# Altium schematic sheet карточка.SchDoc
size A3; SheetNumber: 1; SheetTotal: 1
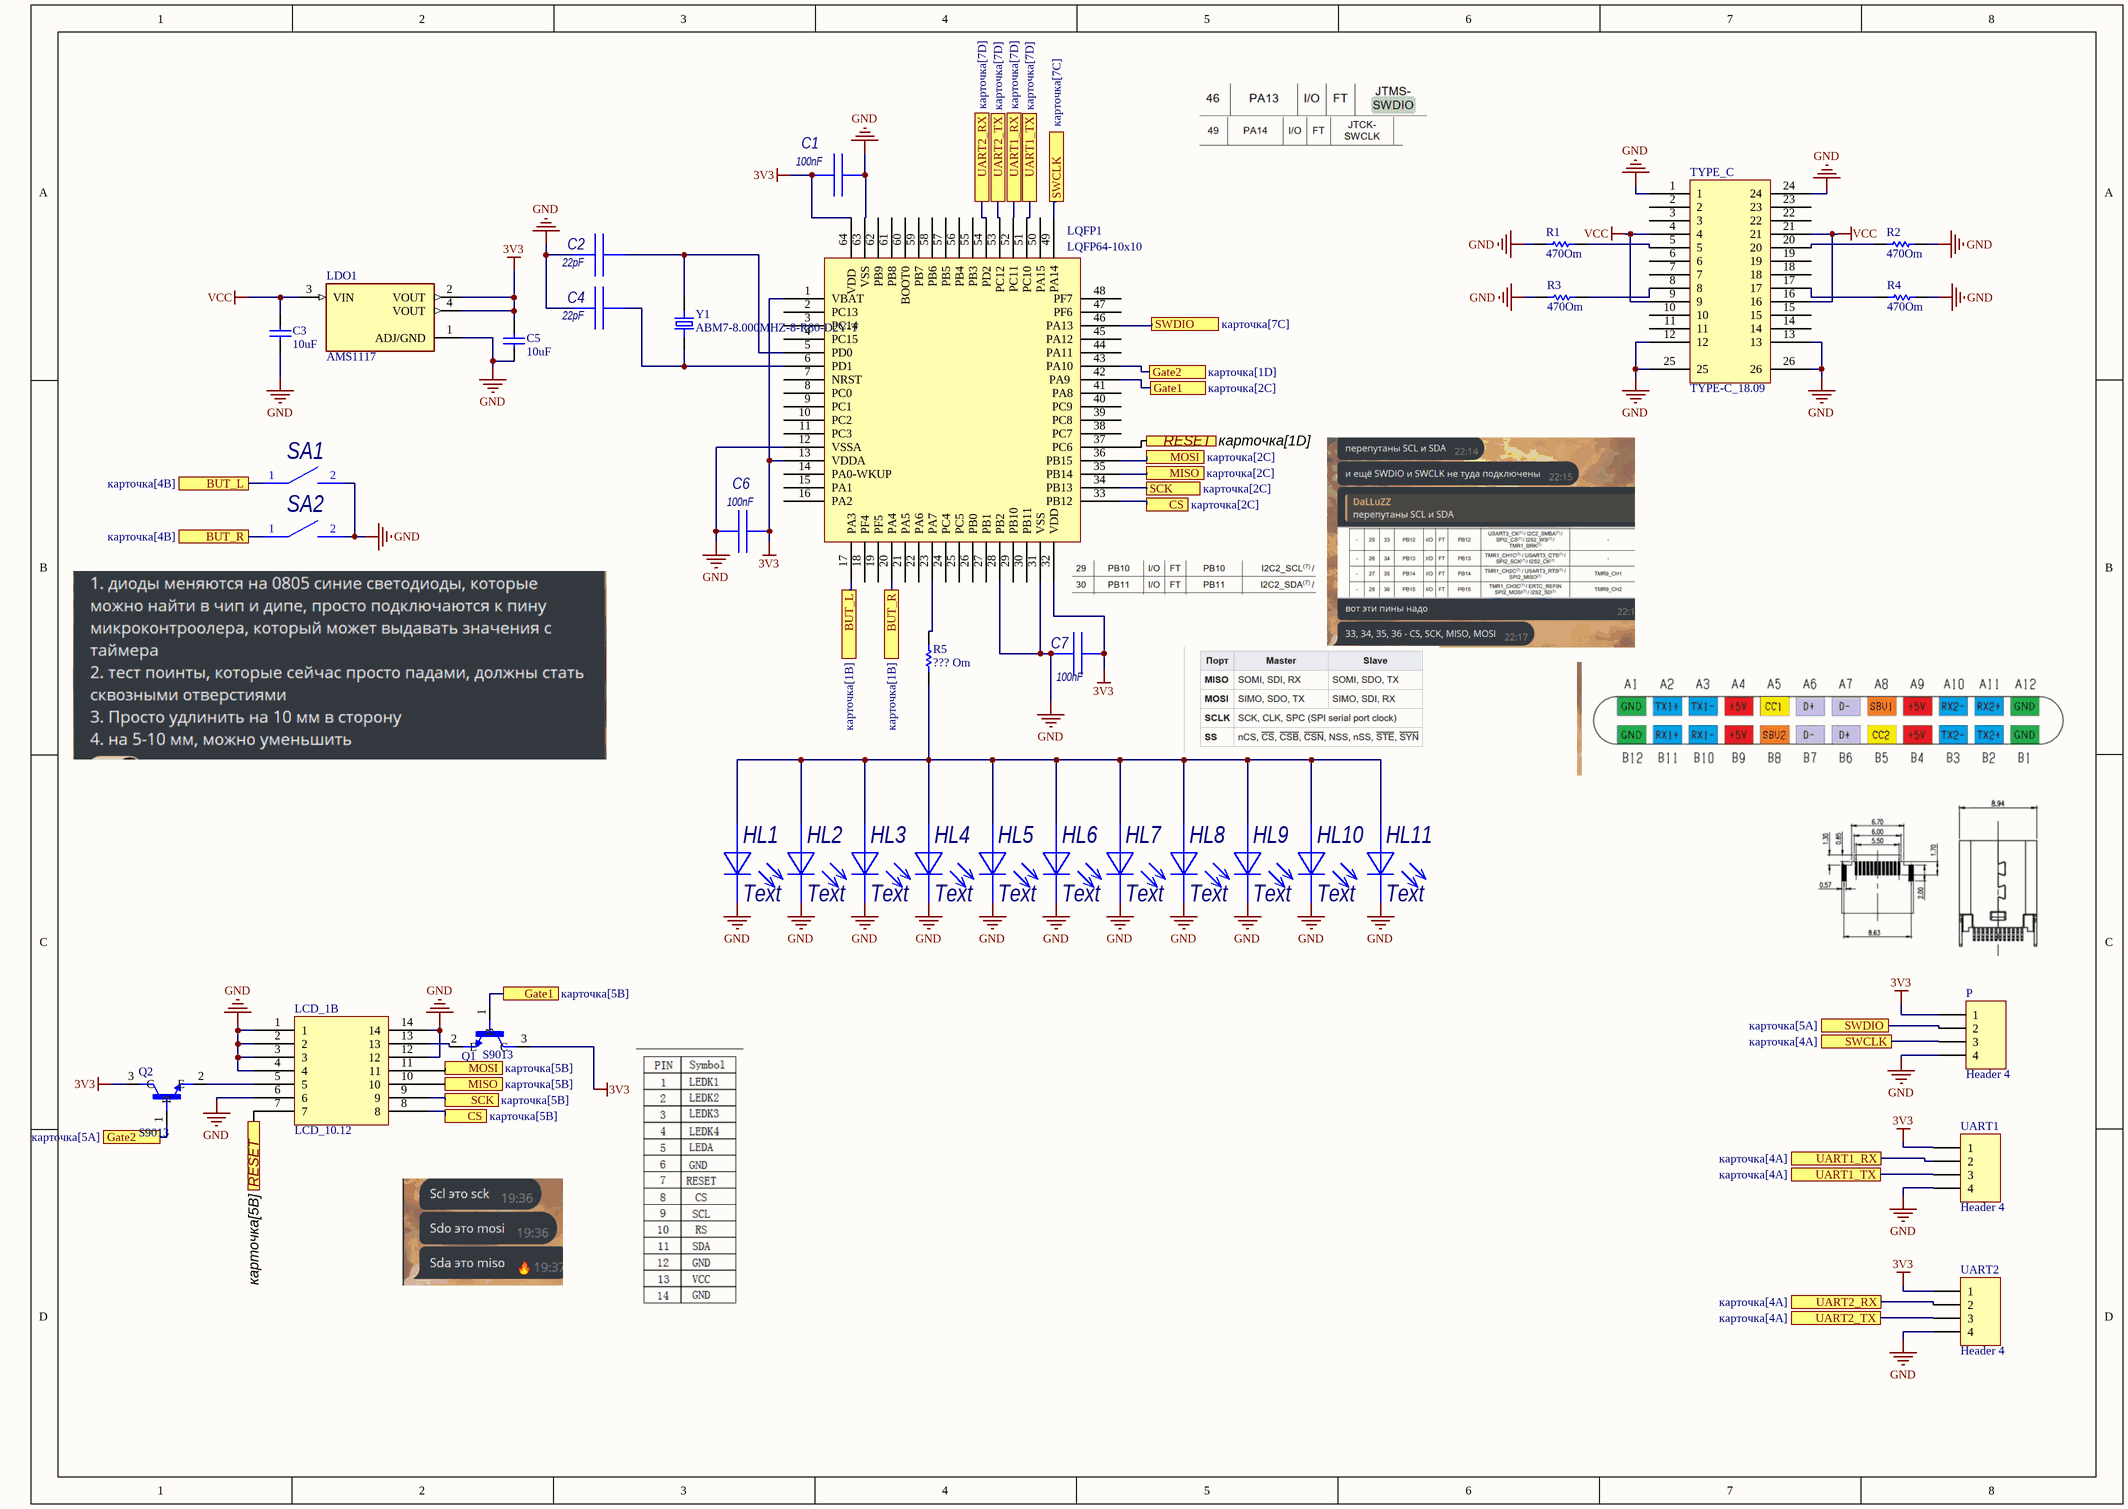
[diagram p0: карточка.SchDoc]

## Parts
C1  100nF  [C0603]
C2  22pF  [C0603]
C3  value 10uF  [C0805]  (hidden comment: Capacitor)
C4  22pF  [C0603]
C5  value 10uF  [C0805]  (hidden comment: Capacitor)
C6  100nF  [C0603]
C7  100nF  [C0603]
HL1  Text  [LD0805]
HL2  Text  [LD0805]
HL3  Text  [LD0805]
HL4  Text  [LD0805]
HL5  Text  [LD0805]
HL6  Text  [LD0805]
HL7  Text  [LD0805]
HL8  Text  [LD0805]
HL9  Text  [LD0805]
HL10  Text  [LD0805]
HL11  Text  [LD0805]
LCD_1  LCD_10.12  [LCD_1]  (part B of 2)
LDO1  AMS1117  [SOT229P700X180-4N]
LQFP1  LQFP64-10x10  [LQFP64-10x10]
P  Header 4  [HDR1X4]
Q1  S9013  [SOT95P240X120-3N]
Q2  S9013  [SOT95P240X120-3N]
R1  value 470Om  [R0603]  (hidden comment: Resistor)
R2  value 470Om  [R0603]  (hidden comment: Resistor)
R3  value 470Om  [R0603]  (hidden comment: Resistor)
R4  value 470Om  [R0603]  (hidden comment: Resistor)
R5  value ??? Om  [R0603]  (hidden comment: Resistor)
SA1  Text  [BASS_02]  (value not drawn)
SA2  Text  [BASS_02]  (value not drawn)
TYPE_  TYPE-C_18.09  [TYPE-C_18.09]  (part C of 3)
UART1  Header 4  [HDR1X4]
UART2  Header 4  [HDR1X4]
Y1  ABM7-8.000MHZ-8-R80-D2Y-T  [XTAL_ABM7-8.000MHZ-8-R80-D2Y-T]

## Ports
BUT_L (see карточка[1B]), BUT_L (see карточка[4B]), BUT_R (see карточка[1B]), BUT_R (see карточка[4B]), CS (see карточка[2C]), CS (see карточка[5B]), Gate1 (see карточка[2C]), Gate1 (see карточка[5B]), Gate2 (see карточка[1D]), Gate2 (see карточка[5A]), MISO (see карточка[2C]), MISO (see карточка[5B]), MOSI (see карточка[2C]), MOSI (see карточка[5B]), RESET (see карточка[1D]), RESET (see карточка[5B]), SCK (see карточка[2C]), SCK (see карточка[5B]), SWCLK (see карточка[4A]), SWCLK (see карточка[7C]), SWDIO (see карточка[5A]), SWDIO (see карточка[7C]), UART1_RX (see карточка[4A]), UART1_RX (see карточка[7D]), UART1_TX (see карточка[4A]), UART1_TX (see карточка[7D]), UART2_RX (see карточка[4A]), UART2_RX (see карточка[7D]), UART2_TX (see карточка[4A]), UART2_TX (see карточка[7D])

## Nets
3V3: C1.1 C5.1 C6.2 C7.2 LDO1.2(VOUT) LDO1.4(VOUT) LQFP1.1(VBAT) LQFP1.13(VDDA) LQFP1.32(VDD) LQFP1.64(VDD) P.1 Q1.3(C) Q2.3(C) UART1.1 UART2.1
GND: C1.2 C2.2 C3.2 C4.2 C5.2 C6.1 C7.1 HL1.2(К) HL2.2(К) HL3.2(К) HL4.2(К) HL5.2(К) HL6.2(К) HL7.2(К) HL8.2(К) HL9.2(К) HL10.2(К) HL11.2(К) LCD_1.1 LCD_1.2 LCD_1.3 LCD_1.4 LCD_1.6 LCD_1.12 LCD_1.14 LDO1.1(ADJ/GND) LQFP1.12(VSSA) LQFP1.28(PB2) LQFP1.31(VSS) LQFP1.63(VSS) P.4 R1.1 R2.1 R3.1 R4.1 SA1.2(B1) SA2.2(B1) TYPE_.1 TYPE_.12 TYPE_.13 TYPE_.24 TYPE_.25 TYPE_.26 UART1.4 UART2.4
VCC: C3.1 LDO1.3(VIN) TYPE_.4 TYPE_.9 TYPE_.16 TYPE_.21
BUT_L: LQFP1.17(PA3) SA1.1(A1) ; port BUT_L
BUT_R: LQFP1.20(PA4) SA2.1(A1) ; port BUT_R
CS: LCD_1.8 LQFP1.33(PB12) ; port CS
Gate1: LQFP1.42(PA9) Q1.1(B) ; port Gate1
Gate2: LQFP1.43(PA10) Q2.1(B) ; port Gate2
MISO: LCD_1.10 LQFP1.35(PB14) ; port MISO
MOSI: LCD_1.11 LQFP1.36(PB15) ; port MOSI
RESET: LCD_1.7 LQFP1.37(PC6) ; port RESET
SCK: LCD_1.9 LQFP1.34(PB13) ; port SCK
SWCLK: LQFP1.49(PA14) P.3 ; port SWCLK
SWDIO: LQFP1.46(PA13) P.2 ; port SWDIO
UART1_RX: LQFP1.52(PC11) UART1.2 ; port UART1_RX
UART1_TX: LQFP1.51(PC10) UART1.3 ; port UART1_TX
UART2_RX: LQFP1.54(PD2) UART2.2 ; port UART2_RX
UART2_TX: LQFP1.53(PC12) UART2.3 ; port UART2_TX
NetC2_1: C2.1 LQFP1.5(PD0) Y1.2
NetC4_1: C4.1 LQFP1.6(PD1) Y1.1
NetHL1_1: HL1.1(А) HL2.1(А) HL3.1(А) HL4.1(А) HL5.1(А) HL6.1(А) HL7.1(А) HL8.1(А) HL9.1(А) HL10.1(А) HL11.1(А) R5.1
NetLCD_1_5: LCD_1.5 Q2.2(E)
NetLCD_1_13: LCD_1.13 Q1.2(E)
NetLQFP1_23: LQFP1.23(PA7) R5.2
NetR1_2: R1.2 TYPE_.5
NetR2_2: R2.2 TYPE_.20
NetR3_2: R3.2 TYPE_.8
NetR4_2: R4.2 TYPE_.17

Not connected (* = marked no-connect by the designer): LQFP1 2(PC13) 3(PC14) 4(PC15) 7(NRST) 8(PC0) 9(PC1) 10(PC2) 11(PC3) 14(PA0-WKUP) 15(PA1) 16(PA2) 18(PF4) 19(PF5) 21(PA5) 22(PA6) 24(PC4) 25(PC5) 26(PB0) 27(PB1) 29(PB10) 30(PB11) 38(PC7) 39(PC8) 40(PC9) 41(PA8) 44(PA11) 45(PA12) 47(PF6) 48(PF7) 50(PA15) 55(PB3) 56(PB4) 57(PB5) 58(PB6) 59(PB7) 60(BOOT0) 61(PB8) 62(PB9); TYPE_ 2 3 6 7 10 11 14 15 18 19 22 23

## Library data of the parts
C1 C2 C4 C6 C7 = Capacitor: Type: Конденсатор; Published: 18.05.2010; Publisher: Andrew Danich
C3 C5 = Capacitor: SimulationGenericComponent: True
HL1-HL11 = Led-1: Type: Индикатор единичный; Published: 03.12.2013; Publisher: Andrew Danich
LDO1 = AMS1117: 1A LOW DROPOUT VOLTAGE REGULATOR SOT-223; MF: Advanced Monolithic Systems; Price: None; Availability: Not in stock; Package: SOT-223 Seeed Technology; MP: AMS1117; Value: *; SnapEDA_Link: https://www.snapeda.com/parts/AMS1117/Advanced+Monolithic+Systems/view-part/?ref=snap; Check_prices: https://www.snapeda.com/parts/AMS1117/Advanced+Monolithic+Systems/view-part/?ref=eda
P UART1 UART2 = Header 4: Header, 4-Pin; LatestRevisionDate: 17-Jul-2002; LatestRevisionNote: Re-released for DXP Platform.; Publisher: Altium Limited
Q1 Q2 = S9013: Bipolar (BJT) Transistor NPN 25 V 500 mA 150MHz 625 mW Through Hole TO-92; MF: Yangjie Technology; Value: *; SnapEDA_Link: https://www.snapeda.com/parts/S9013/E-Tech/view-part/?ref=snap; MP: S9013; Purchase-URL: https://pricing.snapeda.com/search/part/S9013/?ref=eda; Check_prices: https://www.snapeda.com/parts/S9013/E-Tech/view-part/?ref=eda; Availability: In Stock; Price: None; Package: None
R1-R5 = Resistor: TC1: 0; SimulationGenericComponent: True; TC2: 0
SA1 SA2 = SW-01x-01p: Published: 11.04.2014; Publisher: Andrew Danich; Type: Переключатель
Y1 = ABM7-8.000MHZ-8-R80-D2Y-T: Crystal 22.1184MHz Ã‚Â±20ppm (Tol) Ã‚Â±30ppm (Stability) 18pF FUND 50Ohm 2-Pin Mini-CSMD T/R; Package: None; Price: None; Value: *; MP: ABM7-8.000MHZ-8-R80-D2Y-T; Availability: Unavailable